# EAGLE design ltc2945-demo-board (EAGLE 7.5.0)
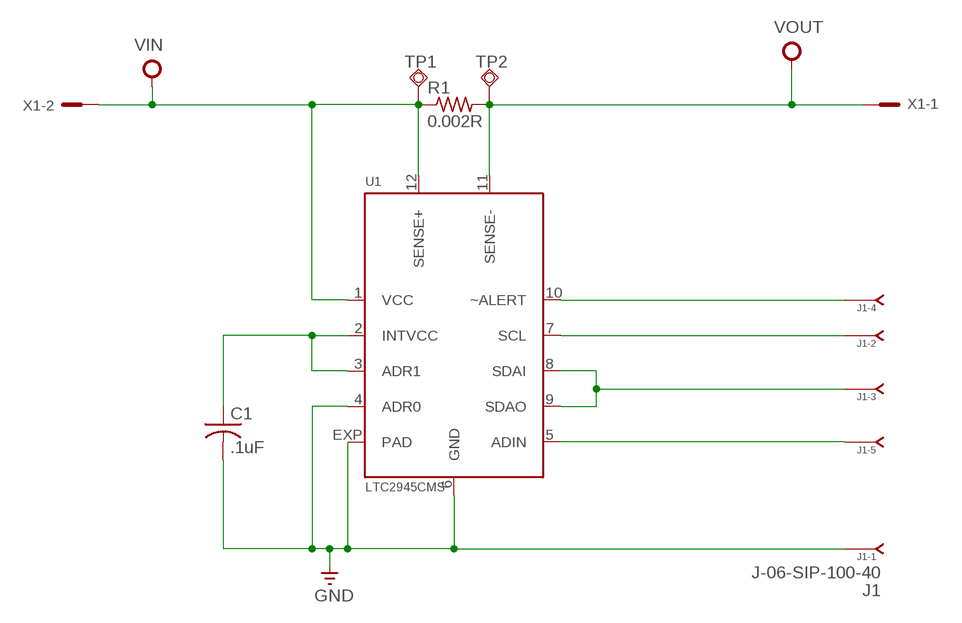
[diagram p0: schematic, sheet 1]

## Parts
C1  .1uF  C-USC0603  [C0603]
J1  J-06-SIP-100-40  [SIP-100-06-40]
R1  0.002R  R-US_R2512  [R2512]
TP1  TPSQPAD1-17  [P1-17]
TP2  TPSQPAD1-17  [P1-17]
U1  LTC2945CMS  [MSOP12]
X1  MCV_05/2-G-2,5  [MC2]

## Nets
GND: C1.2 J1.1 U1.4(ADR0) U1.6(GND) U1.EXP(PAD)
N$2: J1.5 U1.5(ADIN)
N$4: J1.3 U1.8(SDAI) U1.9(SDAO)
N$6: C1.1 U1.2(INTVCC) U1.3(ADR1)
N$8: J1.4 U1.10(~ALERT)
N$9: J1.2 U1.7(SCL)
VIN: R1.1 TP1.TP U1.1(VCC) U1.12(SENSE+) X1.2
VOUT: R1.2 TP2.TP U1.11(SENSE-) X1.1
Unconnected: J1.6

## Library data of the parts
C1 = rcl:C-US: CAPACITOR, American symbol
J1 = con-headers-jp:J-06-: HEADER JACK PINS
R1 = rcl:R-US_: RESISTOR, American symbol
TP1 TP2 = testpad:TPSQ: Test pad
U1 = lucc:LTC2945CMS: LTC2945 Wide Range I2C Power Monitor Rail-to-Rail Input Range: 0V to 80V n Wide Input Supply Range: 2.7V to 80V n Shunt Regulator for Supplies >80V n Δ∑ ADC with less than ±0.75% Total Unadjusted Error n 12-Bit Resolution for Current and Voltages n Internal Multiplier Calculates 24-Bit Power Value n Stores Minimum and Maximum Values n Alerts When Limits Exceeded n Additional ADC Input Monitors an External Voltage n Continuous Scan and Snapshot Modes n Shutdown Mode with IQ < 80µA n Split SDA for Opto-Isolation n Available in 12-Lead 3mm × 3mm QFN and MSOP Packages ABSOLUTE MAXIMUM RATINGS VDD Voltage.............................................. –0.3V to 100V SENSE+ Voltage ...........................................–1V to 100V SENSE– Voltage .....–1V or SENSE+ – 1V to SENSE+ + 1V INTVCC Voltage (Note 3) ........................... –0.3V to 5.9V ADR1, ADR0, ADIN, ALERT, SDAO, SDAO Voltage......................................................... –0.3V to 7V INTVCC Clamp Current ...........................................35mA SCL, SDAI Voltages (Note 4)..................... –0.3V to 5.9V SCL, SDAI Clamp Current ........................................5mA Operating Temperature Range LTC2945C................................................ 0°C to 70°C LTC2945I .............................................–40°C to 85°C LTC2945H.......................................... –40°C to 125°C Storage Temperature Range .................. –65°C to 150°C Lead Temperature (Soldering, 10sec) MS Package Only..............................................300°C
X1 = con-phoenix-250:MCV_05/2-G-2,5: Mini-Combicon 2.50mm 2polig MC(V) 0,5/2-G-2,5

## Board
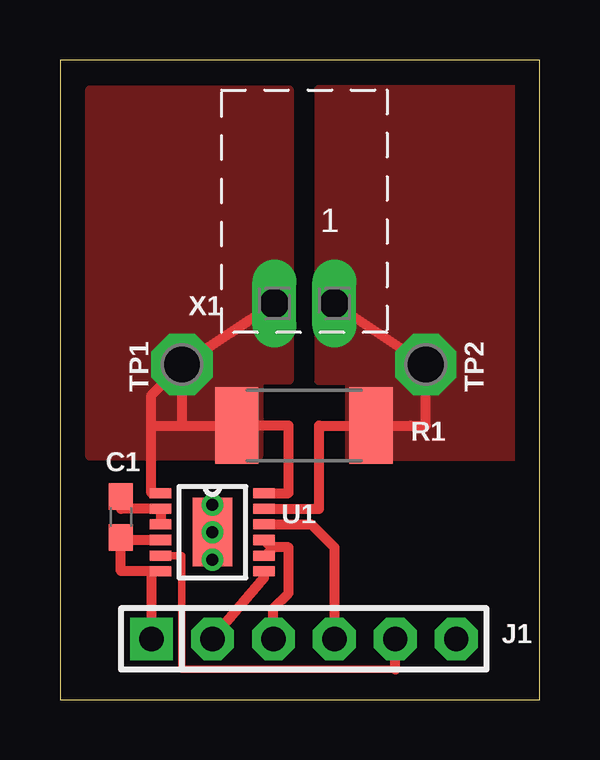
[diagram p1: board, top side]
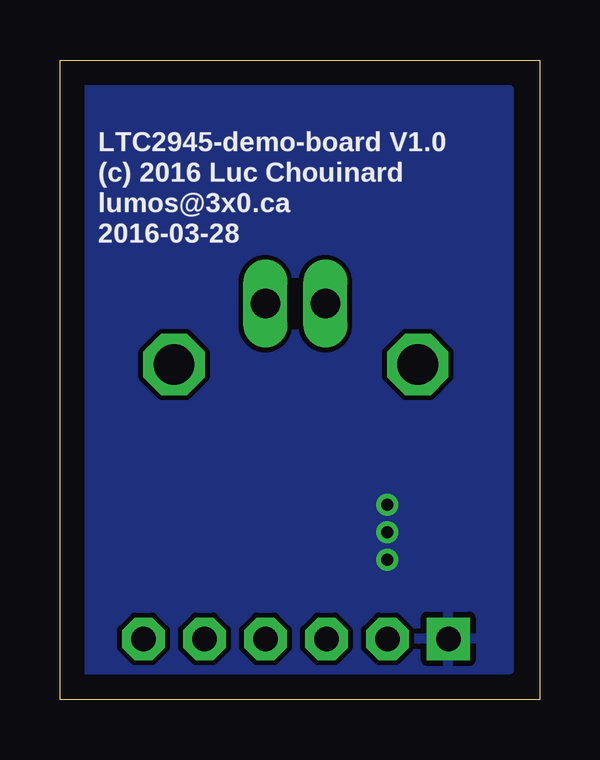
[diagram p2: board, bottom side, seen from below]

Size 19.99 x 26.66 mm. Coordinates in mm from the lower left corner, seen from the top.
Outline: 0,0 19.99,0 19.99,26.66 0,26.66 0,0
Copper layers (1*16): Top 0.035mm / dielectric 1.5mm / Bottom 0.035mm
Design rules "default *": minimum track width 10mil, minimum drill 24mil, track to track 8mil, track to pad 8mil, pad to pad 8mil, via to via 8mil, smd to smd 8mil, copper to edge 40mil, drill to drill 8mil, minimum pad ring 10mil, minimum via ring 8mil, stop-mask expansion 4mil, vias tented up to drill 0mil, thermal gap 10mil

### Footprints (pad centres in the part's own frame; a part is rotated, then mirrored left to right if it is on the bottom)
C0603 = smd 1.1 x 1: 1 -0.85,0; 2 0.85,0
SIP-100-06-40 = drill 1.016 pad 1.778 square: 1 -6.35,0 | drill 1.016 pad 1.778 octagon: 2 -3.81,0; 3 -1.27,0; 4 1.27,0; 5 3.81,0; 6 6.35,0
R2512 = smd 1.8 x 3.2: 1 -2.8,0; 2 2.8,0
P1-17 = drill 1.702 pad 2.54 octagon: TP 0,0
MSOP12 = smd 0.9 x 0.42: 1 -2.163,1.625; 2 -2.163,0.975; 3 -2.163,0.325; 4 -2.163,-0.325; 5 -2.163,-0.975; 6 -2.163,-1.625; 7 2.15,-1.625; 8 2.15,-0.975; 9 2.15,-0.325; 10 2.15,0.325; 11 2.15,0.975; 12 2.15,1.625 | smd 1.65 x 2.85: EXP 0,0
MC2 = drill 1.22 pad 1.676 long: 1 0,0; 2 2.5,0

### Placement (x,y rotation side)
C1  2.54,7.62 270 top
J1  10.16,2.54 0 top
R1  10.16,11.43 0 top
TP1  5.08,13.97 0 top
TP2  15.24,13.97 0 top
U1  6.35,6.99 0 top
X1  11.43,16.51 180 top

### Tracks (layer width: path | path; a pad name or v marks a point on that pad's centre or on a via)
GND  (via drill 0.5)
  Top 0.406: U1.4 2.54,6.66 C1.2 2.54,5.36 U1.6 3.81,5.36 J1.1
  other vias: 6.35,8.13 6.35,6.99 6.35,5.84
  pour Bottom: 1.27,25.4 19.05,25.4 19.05,1.27 1.27,1.27
N$2
  Top 0.305: U1.5 5.08,6.01 5.08,1.27 13.97,1.27
  Top 0.406: 13.97,1.27 J1.5
N$4
  Top 0.406: J1.3 8.89,3.81 9.53,4.45 9.53,6.35 8.89,6.35 | 8.89,6.35 8.81,6.35 U1.9 | U1.8 8.55,6.01 8.89,6.35
N$6
  Top 0.406: C1.1 2.54,7.96 U1.2 U1.3
N$8
  Top 0.406: U1.10 10.47,7.31 11.43,6.35 J1.4
N$9
  Top 0.406: J1.2 8.5,5.08 U1.7
VIN
  Top 0.406: X1.2 TP1.TP | TP1.TP 5.08,11.43 | 5.08,11.43 R1.1 9.53,11.43 9.53,8.61 U1.12 | U1.1 3.81,8.61 3.81,11.43 | 3.81,11.43 5.08,11.43 | 3.81,11.43 3.81,12.7 TP1.TP
  pour Top (no thermals): 8.26,10.16 1.27,10.16 1.27,25.4 9.53,25.4 9.53,13.33 8.26,13.33
VOUT
  Top 0.406: X1.1 TP2.TP 15.24,11.43 14.61,11.43 R1.2 10.79,11.43 10.79,7.96 U1.11
  pour Top (no thermals): 12.07,10.16 19.05,10.16 19.05,25.4 10.79,25.4 10.79,13.33 12.07,13.33

### Text on the board
bNames: LTC2945-demo-board V1.0 | (c) 2016 Luc Chouinard | lumos@3x0.ca | 2016-03-28